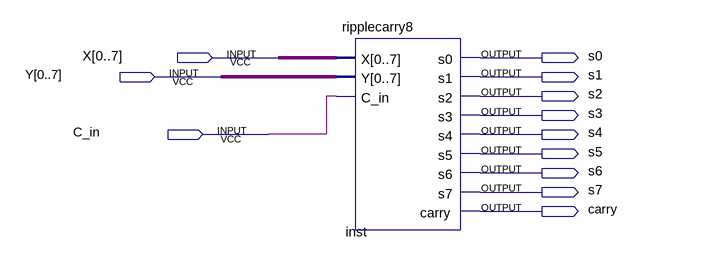
[diagram p0: schematic sheet]
// Quartus schematic ripple2.bdf as structural Verilog: 1 symbols, 12 pins
module ripple2 (
  input  [0:7] X,
  input  [0:7] Y,
  input  C_in,
  output s0,
  output s1,
  output s2,
  output s3,
  output s4,
  output s5,
  output s6,
  output s7,
  output carry
);

  ripplecarry8 inst (
    .X(X), .Y(Y), .C_in(C_in), .s0(s0), .s1(s1), .s2(s2), .s3(s3), .s4(s4), .s5(s5), .s6(s6), .s7(s7),
    .carry(carry));
endmodule
